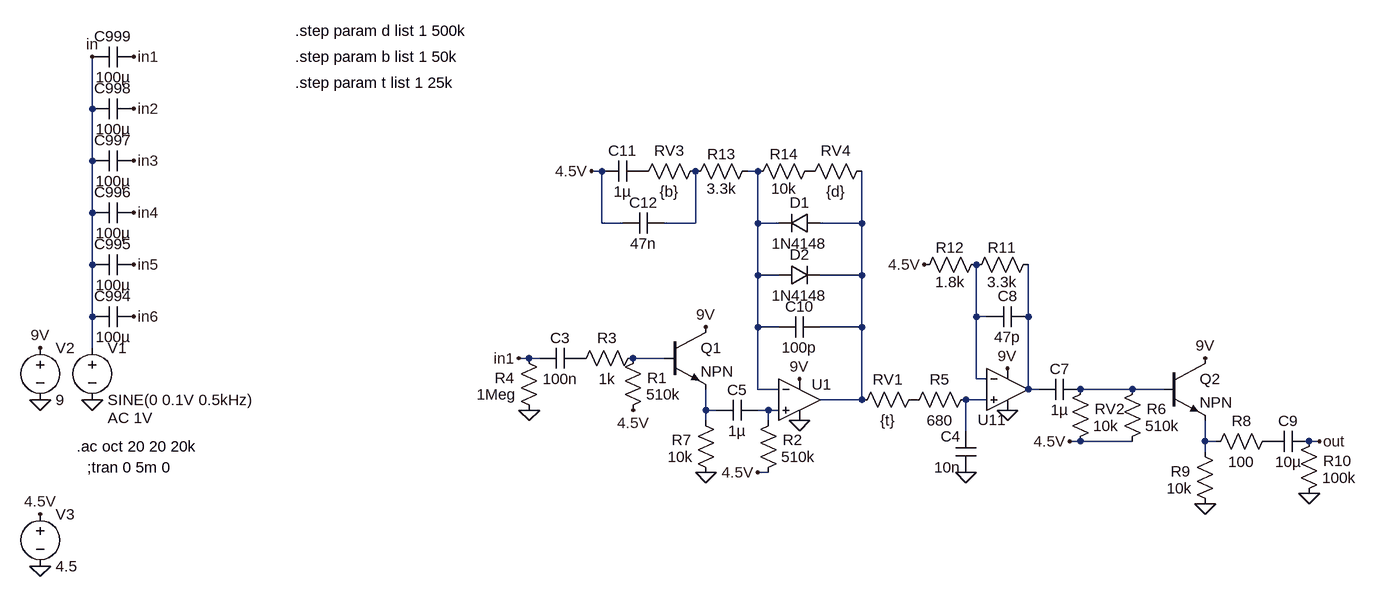
[diagram p0: schematic serotonin.asc]
serotonin.asc, the LTspice schematic file:
Version 4
SHEET 1 3408 3732
WIRE -1568 704 -1568 624
WIRE -1568 784 -1568 704
WIRE -784 800 -800 800
WIRE -544 800 -560 800
WIRE -1568 864 -1568 784
WIRE -784 880 -784 800
WIRE -752 880 -784 880
WIRE -640 880 -640 800
WIRE -640 880 -688 880
WIRE -544 880 -544 800
WIRE -512 880 -544 880
WIRE -384 880 -384 800
WIRE -384 880 -448 880
WIRE -1568 944 -1568 864
WIRE -544 960 -544 880
WIRE -512 960 -544 960
WIRE -384 960 -384 880
WIRE -384 960 -448 960
WIRE -1568 1024 -1568 944
WIRE -208 1024 -208 944
WIRE -192 1024 -208 1024
WIRE -128 1024 -128 944
WIRE -544 1040 -544 960
WIRE -512 1040 -544 1040
WIRE -384 1040 -384 960
WIRE -384 1040 -448 1040
WIRE -1568 1072 -1568 1024
WIRE -896 1088 -912 1088
WIRE -880 1088 -896 1088
WIRE -688 1088 -736 1088
WIRE -208 1120 -208 1024
WIRE -192 1120 -208 1120
WIRE -544 1136 -544 1040
WIRE -512 1136 -544 1136
WIRE -128 1136 -128 1024
WIRE -112 1136 -128 1136
WIRE 32 1136 -48 1136
WIRE 80 1136 32 1136
WIRE -384 1152 -384 1040
WIRE -384 1152 -448 1152
WIRE -192 1152 -224 1152
WIRE -624 1168 -624 1136
WIRE -608 1168 -624 1168
WIRE -528 1168 -544 1168
WIRE -512 1168 -528 1168
WIRE -624 1184 -624 1168
WIRE -528 1184 -528 1168
WIRE -224 1200 -224 1152
WIRE -48 1216 -64 1216
WIRE 32 1216 -48 1216
WIRE 144 1216 144 1184
WIRE 160 1216 144 1216
WIRE 320 1216 304 1216
WIRE 144 1232 144 1216
WIRE -528 1264 -544 1264
FLAG -1568 1152 0
FLAG -1568 624 in
FLAG -1648 1152 0
FLAG -480 1120 9V
FLAG -1504 624 in1
FLAG -1504 704 in2
FLAG -1504 784 in3
FLAG -1504 864 in4
FLAG -1504 944 in5
FLAG -1504 1024 in6
FLAG -912 1088 in1
FLAG -896 1168 0
FLAG -1648 1328 4.5V
FLAG -1648 1408 0
FLAG -736 1168 4.5V
FLAG -624 1040 9V
FLAG -480 1184 0
FLAG -544 1264 4.5V
FLAG -624 1264 0
FLAG -800 800 4.5V
FLAG -224 1264 0
FLAG -160 1168 0
FLAG -160 1104 9V
FLAG -288 944 4.5V
FLAG 144 1088 9V
FLAG 144 1312 0
FLAG 304 1296 0
FLAG 320 1216 out
FLAG -64 1216 4.5V
FLAG -1648 1072 9V
SYMBOL voltage -1568 1056 R0
WINDOW 123 24 124 Left 2
WINDOW 39 0 0 Left 2
SYMATTR Value2 AC 1V
SYMATTR InstName V1
SYMATTR Value SINE(0 0.1V 0.5kHz)
SYMBOL voltage -1648 1056 R0
WINDOW 123 0 0 Left 0
WINDOW 39 0 0 Left 0
SYMATTR InstName V2
SYMATTR Value 9
SYMBOL cap -1504 688 R90
WINDOW 0 0 32 VBottom 2
WINDOW 3 32 32 VTop 2
SYMATTR InstName C998
SYMATTR Value 100µ
SYMBOL cap -1504 768 R90
WINDOW 0 0 32 VBottom 2
WINDOW 3 32 32 VTop 2
SYMATTR InstName C997
SYMATTR Value 100µ
SYMBOL cap -1504 848 R90
WINDOW 0 0 32 VBottom 2
WINDOW 3 32 32 VTop 2
SYMATTR InstName C996
SYMATTR Value 100µ
SYMBOL cap -1504 608 R90
WINDOW 0 0 32 VBottom 2
WINDOW 3 32 32 VTop 2
SYMATTR InstName C999
SYMATTR Value 100µ
SYMBOL cap -1504 928 R90
WINDOW 0 0 32 VBottom 2
WINDOW 3 32 32 VTop 2
SYMATTR InstName C995
SYMATTR Value 100µ
SYMBOL cap -1504 1008 R90
WINDOW 0 0 32 VBottom 2
WINDOW 3 32 32 VTop 2
SYMATTR InstName C994
SYMATTR Value 100µ
SYMBOL res -880 1184 R180
WINDOW 0 38 66 Left 2
WINDOW 3 36 40 Left 2
SYMATTR InstName R4
SYMATTR Value 1Meg
SYMBOL cap -816 1072 R90
WINDOW 0 0 32 VBottom 2
WINDOW 3 32 32 VTop 2
SYMATTR InstName C3
SYMATTR Value 100n
SYMBOL res -752 1184 M180
WINDOW 0 38 66 Left 2
WINDOW 3 36 40 Left 2
SYMATTR InstName R1
SYMATTR Value 510k
SYMBOL cap -688 864 R90
WINDOW 0 0 32 VBottom 2
WINDOW 3 32 32 VTop 2
SYMATTR InstName C12
SYMATTR Value 47n
SYMBOL cap -720 784 R90
WINDOW 0 0 32 VBottom 2
WINDOW 3 32 32 VTop 2
SYMATTR InstName C11
SYMATTR Value 1µ
SYMBOL res -368 784 R90
WINDOW 0 0 56 VBottom 2
WINDOW 3 32 56 VTop 2
SYMATTR InstName RV4
SYMATTR Value {d}
SYMBOL cap -208 1264 R180
WINDOW 0 24 56 Left 2
WINDOW 3 24 8 Left 2
SYMATTR InstName C4
SYMATTR Value 10n
SYMBOL voltage -1648 1312 R0
WINDOW 123 0 0 Left 0
WINDOW 39 0 0 Left 0
SYMATTR InstName V3
SYMATTR Value 4.5
SYMBOL npn -688 1040 R0
SYMATTR InstName Q1
SYMBOL res -720 1072 R90
WINDOW 0 0 56 VBottom 2
WINDOW 3 32 56 VTop 2
SYMATTR InstName R3
SYMATTR Value 1k
SYMBOL res -608 1280 R180
WINDOW 0 38 66 Left 2
WINDOW 3 36 40 Left 2
SYMATTR InstName R7
SYMATTR Value 10k
SYMBOL cap -544 1152 R90
WINDOW 0 0 32 VBottom 2
WINDOW 3 32 32 VTop 2
SYMATTR InstName C5
SYMATTR Value 1µ
SYMBOL res -544 1280 M180
WINDOW 0 38 66 Left 2
WINDOW 3 36 40 Left 2
SYMATTR InstName R2
SYMATTR Value 510k
SYMBOL res -448 784 R90
WINDOW 0 5 56 VBottom 2
WINDOW 3 27 56 VTop 2
SYMATTR InstName R14
SYMATTR Value 10k
SYMBOL cap -448 1024 R90
WINDOW 0 0 32 VBottom 2
WINDOW 3 32 32 VTop 2
SYMATTR InstName C10
SYMATTR Value 100p
SYMBOL diode -448 864 R90
WINDOW 0 0 32 VBottom 2
WINDOW 3 32 32 VTop 2
SYMATTR InstName D1
SYMATTR Value 1N4148
SYMBOL diode -512 976 R270
WINDOW 0 32 32 VTop 2
WINDOW 3 0 32 VBottom 2
SYMATTR InstName D2
SYMATTR Value 1N4148
SYMBOL res -624 784 R90
WINDOW 0 0 56 VBottom 2
WINDOW 3 32 56 VTop 2
SYMATTR InstName RV3
SYMATTR Value {b}
SYMBOL res -288 1136 R90
WINDOW 0 0 56 VBottom 2
WINDOW 3 32 56 VTop 2
SYMATTR InstName RV1
SYMATTR Value {t}
SYMBOL res -208 1136 R90
WINDOW 0 0 56 VBottom 2
WINDOW 3 32 56 VTop 2
SYMATTR InstName R5
SYMATTR Value 680
SYMBOL cap -128 1008 R90
WINDOW 0 0 32 VBottom 2
WINDOW 3 32 32 VTop 2
SYMATTR InstName C8
SYMATTR Value 47p
SYMBOL res -112 928 R90
WINDOW 0 5 56 VBottom 2
WINDOW 3 27 56 VTop 2
SYMATTR InstName R11
SYMATTR Value 3.3k
SYMBOL res -192 928 R90
WINDOW 0 5 56 VBottom 2
WINDOW 3 27 56 VTop 2
SYMATTR InstName R12
SYMATTR Value 1.8k
SYMBOL cap -48 1120 R90
WINDOW 0 0 32 VBottom 2
WINDOW 3 32 32 VTop 2
SYMATTR InstName C7
SYMATTR Value 1µ
SYMBOL res -64 1232 M180
WINDOW 0 38 66 Left 2
WINDOW 3 36 40 Left 2
SYMATTR InstName RV2
SYMATTR Value 10k
SYMBOL res 16 1232 M180
WINDOW 0 38 66 Left 2
WINDOW 3 36 40 Left 2
SYMATTR InstName R6
SYMATTR Value 510k
SYMBOL npn 80 1088 R0
SYMATTR InstName Q2
SYMBOL res 160 1328 R180
WINDOW 0 38 66 Left 2
WINDOW 3 36 40 Left 2
SYMATTR InstName R9
SYMATTR Value 10k
SYMBOL cap 304 1200 R90
WINDOW 0 0 32 VBottom 2
WINDOW 3 32 32 VTop 2
SYMATTR InstName C9
SYMATTR Value 10µ
SYMBOL res 256 1200 R90
WINDOW 0 0 56 VBottom 2
WINDOW 3 32 56 VTop 2
SYMATTR InstName R8
SYMATTR Value 100
SYMBOL res 288 1312 M180
WINDOW 0 38 66 Left 2
WINDOW 3 36 40 Left 2
SYMATTR InstName R10
SYMATTR Value 100k
SYMBOL res -544 784 R90
WINDOW 0 5 56 VBottom 2
WINDOW 3 27 56 VTop 2
SYMATTR InstName R13
SYMATTR Value 3.3k
SYMBOL Opamps\\UniversalOpamp2 -480 1152 R0
WINDOW 0 19 -24 Left 2
SYMATTR InstName U1
SYMBOL Opamps\\UniversalOpamp2 -160 1136 R0
WINDOW 0 -46 47 Left 2
SYMATTR InstName U11
TEXT -1592 1224 Left 2 !.ac oct 20 20 20k
TEXT -1576 1256 Left 2 !;tran 0 5m 0
TEXT -1256 584 Left 2 !.step param d list 1 500k
TEXT -1256 624 Left 2 !.step param b list 1 50k
TEXT -1256 664 Left 2 !.step param t list 1 25k

The netlist it stands for:
* serotonin.asc
V1 in 0 SINE(0 0.1V 0.5kHz) AC 1V
V2 9V 0 9
C998 in2 in 100µ
C997 in3 in 100µ
C996 in4 in 100µ
C999 in1 in 100µ
C995 in5 in 100µ
C994 in6 in 100µ
R4 0 in1 1Meg
C3 P001 in1 100n
R1 4.5V N006 510k
C12 N002 4.5V 47n
C11 P002 4.5V 1µ
RV4 N003 P003 {d}
C4 0 N008 10n
V3 4.5V 0 4.5
Q1 9V N006 N009 0 NPN
R3 N006 P001 1k
R7 0 N009 10k
C5 N010 N009 1µ
R2 4.5V N010 510k
R14 P003 N001 10k
C10 N003 N001 100p
D1 N003 N001 1N4148
D2 N001 N003 1N4148
RV3 N002 P002 {b}
RV1 P004 N003 {t}
R5 N008 P004 680
C8 N005 N004 47p
R11 N005 N004 3.3k
R12 N004 4.5V 1.8k
C7 N007 N005 1µ
RV2 4.5V N007 10k
R6 4.5V N007 510k
Q2 9V N007 N011 0 NPN
R9 0 N011 10k
C9 out P005 10µ
R8 P005 N011 100
R10 0 out 100k
R13 N001 N002 3.3k
XU1 N010 N001 9V 0 N003 level.2 Avol=1Meg GBW=10Meg Slew=10Meg ilimit=25m rail=0 Vos=0 phimargin=45 en=0 enk=0 in=0 ink=0 Rin=500Meg  ; pins IN+ IN- V+ V- OUT
XU11 N008 N004 9V 0 N005 level.2 Avol=1Meg GBW=10Meg Slew=10Meg ilimit=25m rail=0 Vos=0 phimargin=45 en=0 enk=0 in=0 ink=0 Rin=500Meg  ; pins IN+ IN- V+ V- OUT
.model D D
.lib standard.dio
.model NPN NPN
.model PNP PNP
.lib standard.bjt
.ac oct 20 20 20k
;tran 0 5m 0
.step param d list 1 500k
.step param b list 1 50k
.step param t list 1 25k
.lib UniversalOpamps2.sub
.backanno
.end